# Altium schematic sheet MEC8_Expansion.SchDoc: <title>
size C; Organization: Custom Embedded Solutions, LLC.; Address1: 130 Oakland Trace; Address2: Madison, AL 35758; DocumentNumber: <doc_num>; Revision: <Rev>; SheetNumber: 7; SheetTotal: 8; PageTitle: MEC8 Expansion Interface
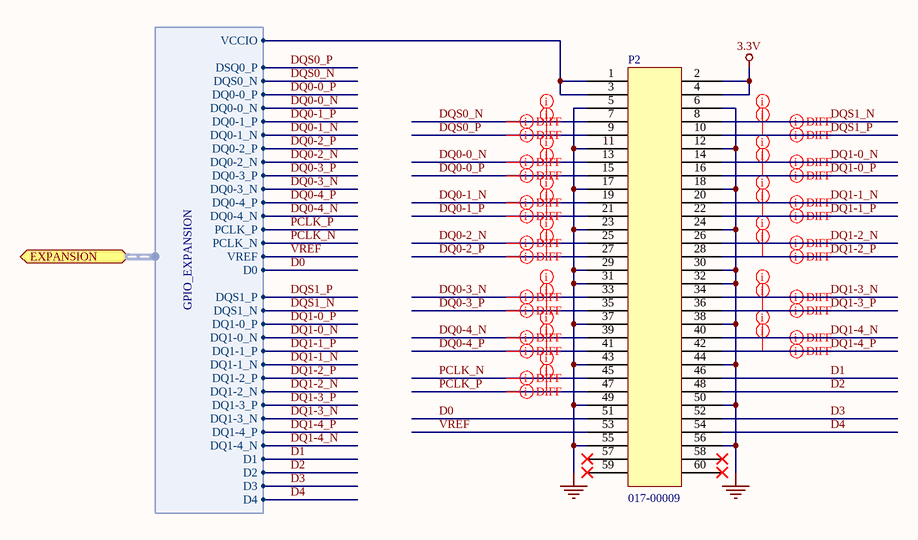
[diagram p0: MEC8_Expansion.SchDoc]

## Parts
P2  Part Number: 017-00009  [005-00021]  (no BOM)

## Ports
EXPANSION (harness GPIO_EXPANSION)

## Harnesses
GPIO_EXPANSION: DSQ0_P, DQS0_N, DQ0-0_P, DQ0-0_N, DQ0-1_P, DQ0-1_N, DQ0-2_P, DQ0-2_N, DQ0-3_P, DQ0-3_N, DQ0-4_P, DQ0-4_N, PCLK_P, PCLK_N, VREF, D0, DQS1_P, DQS1_N, DQ1-0_P, DQ1-0_N, DQ1-1_P, DQ1-1_N, DQ1-2_P, DQ1-2_N, DQ1-3_P, DQ1-3_N, DQ1-4_P, DQ1-4_N, D1, D2, D3, D4, VCCIO

## Nets
3.3V: P2.2 P2.4
GND: P2.5 P2.6 P2.11 P2.12 P2.17 P2.18 P2.23 P2.24 P2.29 P2.30 P2.31 P2.32 P2.37 P2.38 P2.43 P2.44 P2.49 P2.50 P2.55 P2.56
D0: P2.51 ; port EXPANSION.D0
D1: P2.46 ; port EXPANSION.D1
D2: P2.48 ; port EXPANSION.D2
D3: P2.52 ; port EXPANSION.D3
D4: P2.54 ; port EXPANSION.D4
DQ0-0_N: P2.13 ; port EXPANSION.DQ0-0_N
DQ0-0_P: P2.15 ; port EXPANSION.DQ0-0_P
DQ0-1_N: P2.19 ; port EXPANSION.DQ0-1_N
DQ0-1_P: P2.21 ; port EXPANSION.DQ0-1_P
DQ0-2_N: P2.25 ; port EXPANSION.DQ0-2_N
DQ0-2_P: P2.27 ; port EXPANSION.DQ0-2_P
DQ0-3_N: P2.33 ; port EXPANSION.DQ0-3_N
DQ0-3_P: P2.35 ; port EXPANSION.DQ0-3_P
DQ0-4_N: P2.39 ; port EXPANSION.DQ0-4_N
DQ0-4_P: P2.41 ; port EXPANSION.DQ0-4_P
DQ1-0_N: P2.14 ; port EXPANSION.DQ1-0_N
DQ1-0_P: P2.16 ; port EXPANSION.DQ1-0_P
DQ1-1_N: P2.20 ; port EXPANSION.DQ1-1_N
DQ1-1_P: P2.22 ; port EXPANSION.DQ1-1_P
DQ1-2_N: P2.26 ; port EXPANSION.DQ1-2_N
DQ1-2_P: P2.28 ; port EXPANSION.DQ1-2_P
DQ1-3_N: P2.34 ; port EXPANSION.DQ1-3_N
DQ1-3_P: P2.36 ; port EXPANSION.DQ1-3_P
DQ1-4_N: P2.40 ; port EXPANSION.DQ1-4_N
DQ1-4_P: P2.42 ; port EXPANSION.DQ1-4_P
DQS0_N: P2.7 ; port EXPANSION.DQS0_N
DQS0_P: P2.9 ; port EXPANSION.DSQ0_P
DQS1_N: P2.8 ; port EXPANSION.DQS1_N
DQS1_P: P2.10 ; port EXPANSION.DQS1_P
PCLK_N: P2.45 ; port EXPANSION.PCLK_N
PCLK_P: P2.47 ; port EXPANSION.PCLK_P
VREF: P2.53 ; port EXPANSION.VREF
NetP2_1: P2.1 P2.3 ; port EXPANSION.VCCIO

Not connected (* = marked no-connect by the designer): P2 57* 58* 59* 60*

## Layout directives
differential pair: DQ0-0_N, DQ0-0_P, DQ0-1_N, DQ0-1_P, DQ0-2_N, DQ0-2_P, DQ0-3_N, DQ0-3_P, DQ0-4_N, DQ0-4_P, DQ1-0_N, DQ1-0_P, DQ1-1_N, DQ1-1_P, DQ1-2_N, DQ1-2_P, DQ1-3_N, DQ1-3_P, DQ1-4_N, DQ1-4_P, DQS0_N, DQS0_P, DQS1_N, DQS1_P, PCLK_N, PCLK_P
rule Matched Net Lengths [Tolerance = 25mil]; rule Differential Pairs Routing [Pref Gap = 0.125mm    Min Gap  = 0.125mm    Max Gap  = 1mmPref Width = 0.264mm    Min Width  = 0.095mm    Max Width  = 0.264mm]: DQ0-0_N, DQ0-0_P, DQ0-1_N, DQ0-1_P, DQ0-2_N, DQ0-2_P, DQ0-3_N, DQ0-3_P, DQ0-4_N, DQ0-4_P, DQ1-0_N, DQ1-0_P, DQ1-1_N, DQ1-1_P, DQ1-2_N, DQ1-2_P, DQ1-3_N, DQ1-3_P, DQ1-4_N, DQ1-4_P, DQS0_N, DQS0_P, DQS1_N, DQS1_P, PCLK_N, PCLK_P

## Notes on the sheet
- Copyright (c)
- Page Title
- Design Title
- Creative Commons License, http://creativecommons.org/licenses/by/4.0/legalcode
  This PCB design by Custom Embedded Solutions, LLC. is licensed under a Creative Commons Attribution 4.0 International License.
- Size:
- Date:
- File:
- C
- Document Number:
- Time:
- Sheet
- Rev:
- of

## Library data of the parts
P2 = 017-00009: CONN RCPT MEC8 60 POS; Manufacturer1 Part Number: MEC8-130-02-L-D-RA1; Manufacturer1: Samtec; Circuits: 60; Type: Receptacle; Package: MEC8, 0.8mm x 120 position